# EAGLE schematic 17341 (EAGLE 7.6.0)

## Sheet 1 of 3
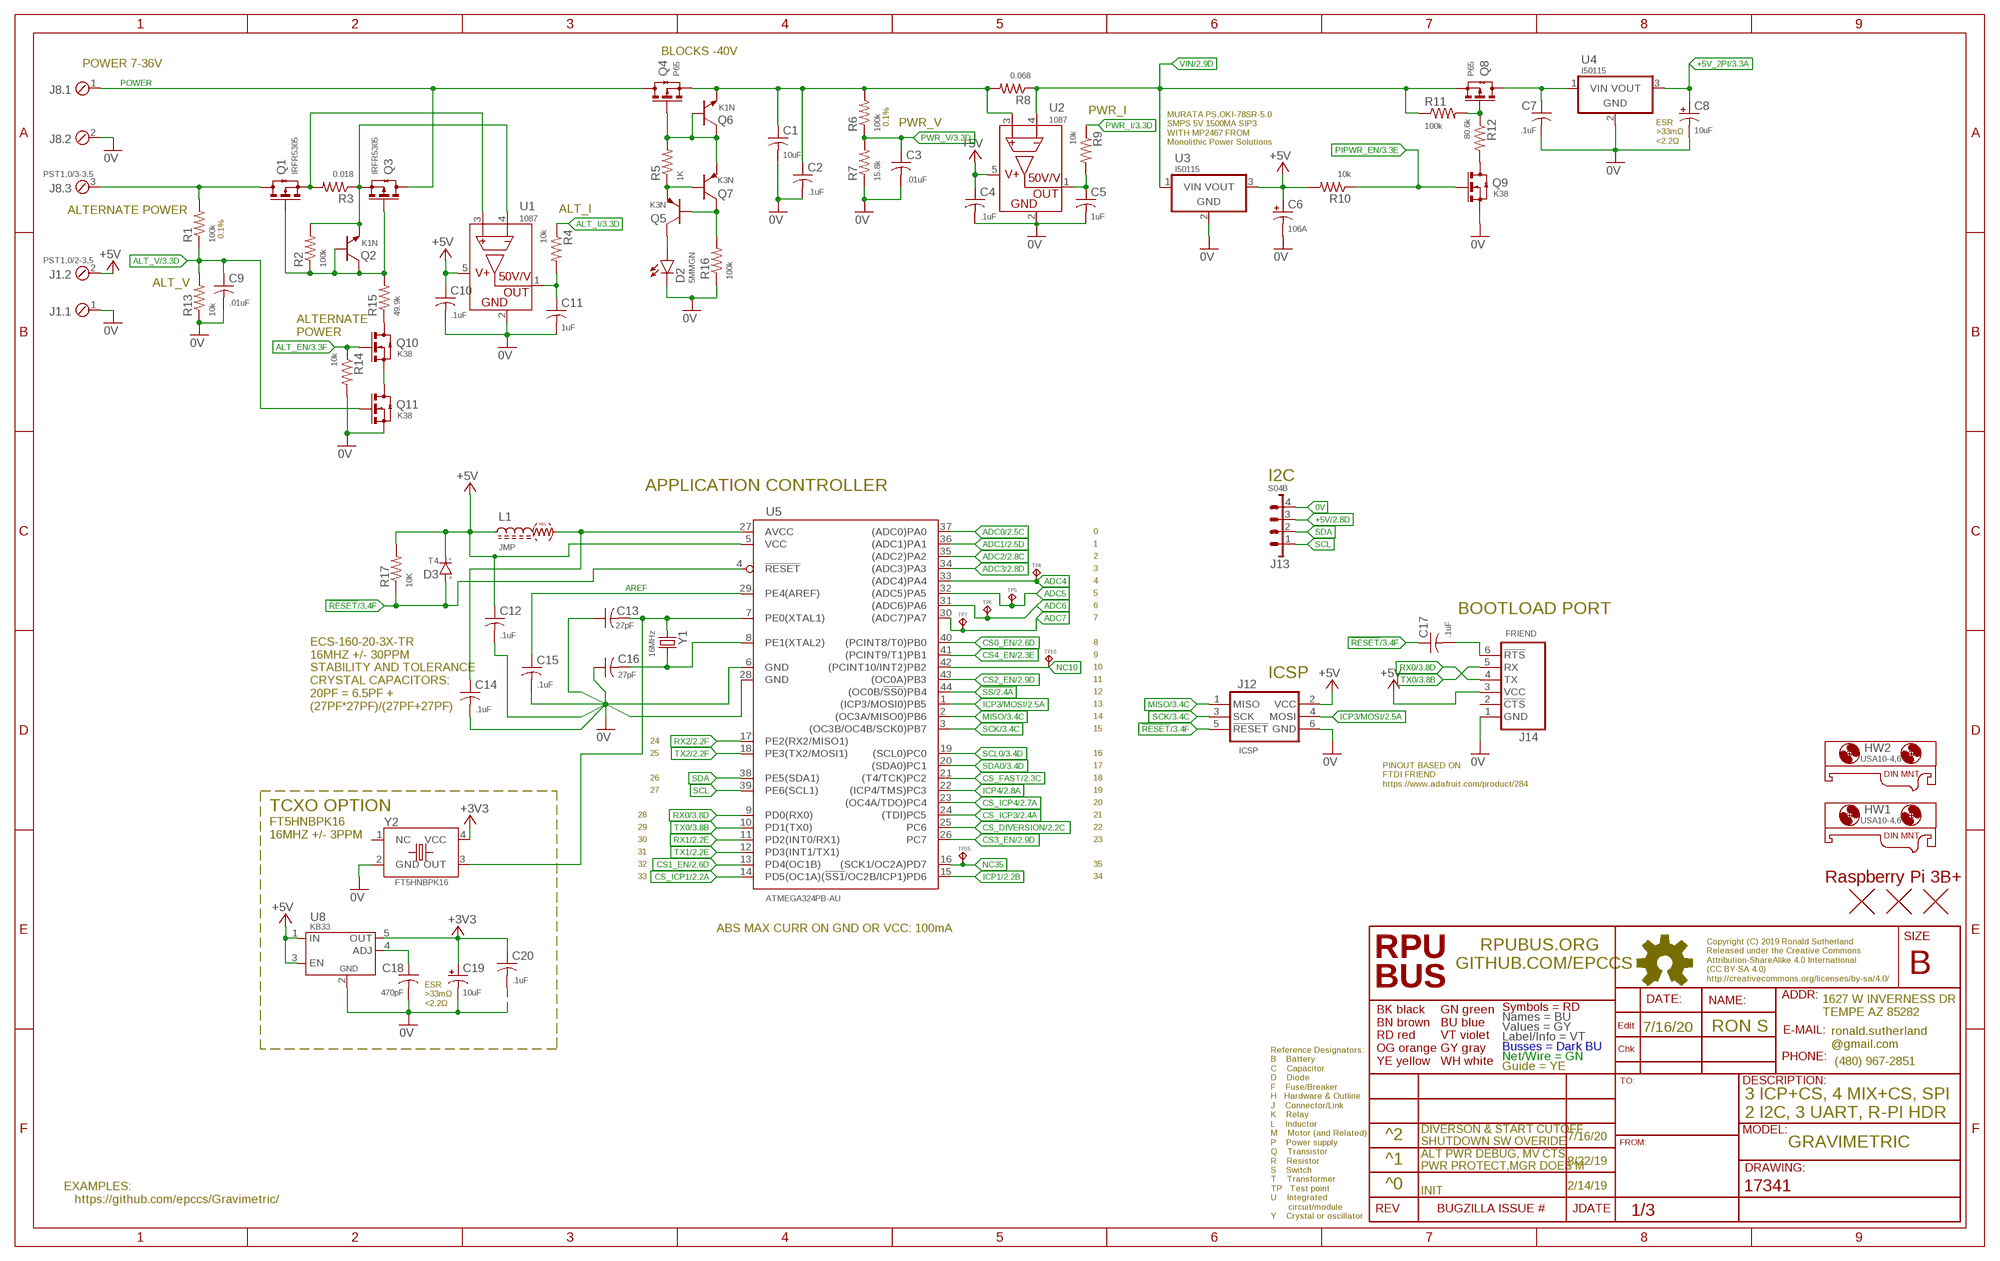
[diagram p0: schematic, sheet 1]

### Parts
C1  10uF  CC1206  [C1206(3216)]
C2  .1uF  CC0805A  [C0805(2012)]
C3  .01uF  CC0603A  [C0603(1608)]
C4  .1uF  CC0603A  [C0603(1608)]
C5  1uF  CC0805A  [C0805(2012)]
C6  106A  CT1206  [3216]
C7  .1uF  CC0603A  [C0603(1608)]
C8  10uF  CT1206  [3216]
C9  .01uF  CC0603A  [C0603(1608)]
C10  .1uF  CC0603A  [C0603(1608)]
C11  1uF  CC0805A  [C0805(2012)]
C12  .1uF  CC0603A  [C0603(1608)]
C13  27pF  CC0603A  [C0603(1608)]
C14  .1uF  CC0603A  [C0603(1608)]
C15  .1uF  CC0603A  [C0603(1608)]
C16  27pF  CC0603A  [C0603(1608)]
C17  .1uF  CC0603A  [C0603(1608)]
C18  470pF  CC0603A  [C0603(1608)]
C19  10uF  CT1206  [3216]
C20  .1uF  CC0603A  [C0603(1608)]
D2  5MMGN  LED5MM  [LED5MM]
D3  T4  DSOD123  [SOD123]
HW1  USA10-4,6  MOUNT-HOLE5.0  [USA10]
HW2  USA10-4,6  MOUNT-HOLE5.0  [USA10]
J1  PST1,0/2-3,5  MCV2  [MCV2]
J8  PST1,0/3-3,5  MCV3  [MCV3]
J12  ICSP  ISP-SPIPTH  [ISP]
J13  S04B  B04B  [B04B]
J14  FRIEND  [FRIEND]
L1  JMP  L0805  [C0805(2012)]
Q1  IRFR5305  N-CHDPAK  [DPAK]
Q2  K1N  NPNSOT23  [SOT23]
Q3  IRFR5305  N-CHDPAK  [DPAK]
Q4  P65  N-CHSOT23  [SOT23]
Q5  K3N  PNPSOT23  [SOT23]
Q6  K1N  NPNSOT23  [SOT23]
Q7  K3N  PNPSOT23  [SOT23]
Q8  P65  N-CHSOT23  [SOT23]
Q9  K38  N-CHSOT23  [SOT23]
Q10  K38  N-CHSOT23  [SOT23]
Q11  K38  N-CHSOT23  [SOT23]
R1  100k  R0805  [C0805(2012)]
R2  100k  R0805  [C0805(2012)]
R3  0.018  R1210  [C1210(3225)]
R4  10k  R0805  [C0805(2012)]
R5  1K  R0805  [C0805(2012)]
R6  100k  R0805  [C0805(2012)]
R7  15.8k  R0805  [C0805(2012)]
R8  0.068  R1210  [C1210(3225)]
R9  10k  R0805  [C0805(2012)]
R10  10k  R0805  [C0805(2012)]
R11  100k  R0805  [C0805(2012)]
R12  80.6k  R0805  [C0805(2012)]
R13  10k  R0805  [C0805(2012)]
R14  10k  R0805  [C0805(2012)]
R15  49.9k  R0805  [C0805(2012)]
R16  100k  R0805  [C0805(2012)]
R17  10K  R0805  [C0805(2012)]
TP4  TPPAD1-08  [P1-08]
TP5  TPPAD1-08  [P1-08]
TP6  TPPAD1-08  [P1-08]
TP7  TPPAD1-08  [P1-08]
TP10  TPPAD1-08  [P1-08]
TP35  TPPAD1-08  [P1-08]
U1  1087  ZXCT1087  [SOT23-5]
U2  1087  ZXCT1087  [SOT23-5]
U3  I50115  OKI-78SR-H  [OKI-78SR-H]
U4  I50115  OKI-78SR-H  [OKI-78SR-H]
U5  ATMEGA324PB-AU  [TQFP44]
U8  KB33  MIC5205  [SOT23-5,SOT25]
U$1  R-PI3B+  [R-PI3B+]
U$2  FIDUCIAL1.27  [FIDUCIAL-1.27]
U$3  FIDUCIAL1.27  [FIDUCIAL-1.27]
U$4  FIDUCIAL1.27  [FIDUCIAL-1.27]
Y1  16MHz  CSM-3X  [CSM-3X]
Y2  FT5HNBPK16  FT5HNBPK  [CRYSTAL5X3.2MM]

### Nets
0V: C1.2 C2.2 C3.2 C4.2 C5.2 C6.- C7.2 C8.- C9.2 C10.2 C11.2 C12.2 C13.1 C14.2 C15.2 C16.1 C18.2 C19.- C20.2 D2.K J1.1 J8.2 J12.6(GND) J13.4 J14.1(GND) Q9.2(S)(S) Q11.2(S)(S) R7.1 R13.1 R14.2 R16.1 U1.2(GND) U2.2(GND) U3.2(GND) U4.2(GND) U5.6(GND) U5.28(GND) U8.2(GND) Y2.2(GND) ; also sheet 2,3
!RESET!: C17.1 D3.A J12.5(!RESET) R17.1 U5.4(!RESET) ; also sheet 3
!SS: U5.44((OC0B/!SS0!)PB4) ; also sheet 2,3
+3V3: C19.+ C20.1 U8.5(OUT) Y2.4(VCC)
+5V: C4.1 C6.+ C10.1 C12.1 D3.C(K) J1.2 J12.2(VCC) J13.3 J14.3(VCC) L1.1 R10.2 R17.2 U1.5(VCC) U2.5(VCC) U3.3(VOUT) U5.5(VCC) U8.1(IN) U8.3(EN) ; also sheet 2,3
+5V_2PI: C8.+ U4.3(VOUT) ; also sheet 3
ADC0: U5.37((ADC0)PA0) ; also sheet 2
ADC1: U5.36((ADC1)PA1) ; also sheet 2
ADC2: U5.35((ADC2)PA2) ; also sheet 2
ADC3: U5.34((ADC3)PA3) ; also sheet 2
ADC4: TP4.TP U5.33((ADC4)PA4)
ADC5: TP5.TP U5.32((ADC5)PA5)
ADC6: TP6.TP U5.31((ADC6)PA6)
ADC7: TP7.TP U5.30((ADC7)PA7)
ALT_EN: Q10.1(G)(G) R14.1 ; also sheet 3
ALT_I: R4.1 ; also sheet 3
ALT_V: C9.1 Q11.1(G)(G) R1.1 R13.2 ; also sheet 3
AREF: C15.1 U5.29(PE4(AREF))
CS0_EN: U5.40((PCINT8/T0)PB0) ; also sheet 2
CS1_EN: U5.13(PD4(OC1B)) ; also sheet 2
CS2_EN: U5.43((OC0A)PB3) ; also sheet 2
CS3_EN: U5.26(PC7) ; also sheet 2
CS4_EN: U5.41((PCINT9/T1)PB1) ; also sheet 2
CS_DIVERSION: U5.25(PC6) ; also sheet 2
CS_FAST: U5.21((T4/TCK)PC2) ; also sheet 2
CS_ICP1: U5.14(PD5(OC1A)) ; also sheet 2
CS_ICP3: U5.24((TDI)PC5) ; also sheet 2
CS_ICP4: U5.23((OC4A/TDO)PC4) ; also sheet 2
ICP1: U5.15((!SS1!/OC2B/ICP1)PD6) ; also sheet 2
ICP3/MOSI: J12.4(MOSI) U5.1((ICP3/MOSI0)PB5) ; also sheet 2,3
ICP4: U5.22((ICP4/TMS)PC3) ; also sheet 2
MISO: J12.1(MISO) U5.2((OC3A/MISO0)PB6) ; also sheet 3
N$2: Q8.1(G)(G) R11.2 R12.1
N$4: Q9.3(D)(D) R12.2
N$5: Q5.B Q7.C R16.2
N$6: Q4.1(G)(G) Q6.B Q6.C Q7.E R5.2
N$7: D2.A Q5.C
N$8: C5.1 R9.2 U2.1(OUT)
N$10: Q5.E Q7.B R5.1
N$31: J8.3 Q1.SINK(D) R1.2
N$32: Q2.E Q3.3(S) R2.2 R3.1 U1.4(S-)
N$33: Q1.1(G) Q2.B Q2.C Q3.1(G) R2.1 R15.2
N$34: Q10.3(D)(D) R15.1
N$35: C17.2 J14.6(!RTS)
N$65: C11.1 R4.2 U1.1(OUT)
N$66: Q1.3(S) R3.2 U1.3(S+)
N$71: C16.2 U5.8(PE1(XTAL2)) Y1.2
N$75: C18.1 U8.4(ADJ)
N$77: C14.1 L1.2 U5.27(AVCC)
N$80: C13.2 U5.7(PE0(XTAL1)) Y1.1 Y2.3(OUT)
N$97: Q10.2(S)(S) Q11.3(D)(D)
NC10: TP10.TP U5.42((PCINT10/INT2)PB2)
NC35: TP35.TP U5.16((SCK1/OC2A)PD7)
PIPWR_EN: Q9.1(G)(G) R10.1 ; also sheet 3
POWER: J8.1 Q3.SINK(D) Q4.3(D)(D)
PWR_I: R9.1 ; also sheet 3
PWR_V: C3.1 R6.1 R7.2 ; also sheet 3
RX0: J14.4(TX) U5.9(PD0(RX0)) ; also sheet 3
RX1: U5.11(PD2(INT0/RX1)) ; also sheet 2
RX2: U5.17(PE2(RX2/MISO1)) ; also sheet 2
SCK: J12.3(SCK) U5.3((OC3B/OC4B/SCK0)PB7) ; also sheet 3
SCL: J13.1 U5.39(PE6(SCL1))
SCL0: U5.19((SCL0)PC0) ; also sheet 3
SDA: J13.2 U5.38(PE5(SDA1))
SDA0: U5.20((SDA0)PC1) ; also sheet 3
SHLD_VIN: C7.1 Q8.3(D)(D) U4.1(VIN)
TX0: J14.5(RX) U5.10(PD1(TX0)) ; also sheet 3
TX1: U5.12(PD3(INT1/TX1)) ; also sheet 2
TX2: U5.18(PE3(TX2/MOSI1)) ; also sheet 2
VIN: Q8.2(S)(S) R8.1 R11.1 U2.4(S-) U3.1(VIN) ; also sheet 2
VIN_S: C1.1 C2.1 Q4.2(S)(S) Q6.E R6.2 R8.2 U2.3(S+)
Unconnected: J14.2(!CTS) Y2.1(NC)

### Notes on the sheet
- BLOCKS -40V
- POWER 7-36V
- PWR_I
- 0.1% | PWR_V
- ESR
  >33mΩ
  <2.2Ω
- MURATA PS,OKI-78SR-5.0
  SMPS 5V 1500MA SIP3
  WITH MP2467 FROM 
  Monolithic Power Solutions
- ALTERNATE POWER | ALT_I
- 0.1%
- ALT_V
- ALTERNATE
  POWER
- I2C
- APPLICATION CONTROLLER
- 0
- 1
- 2
- 3
- 4
- 5
- 6
- BOOTLOAD PORT
- 7
- 8
- 9
- 10
- ICSP
- 11
- 12
- 13
- ECS-160-20-3X-TR
  16MHZ +/- 30PPM
  STABILITY AND TOLERANCE
  CRYSTAL CAPACITORS:
  20PF = 6.5PF +
  (27PF*27PF)/(27PF+27PF)
- 14
- 15
- 24
- 25 | 16
- 17
- 26 | 18
- PINOUT BASED ON
  FTDI FRIEND
  https://www.adafruit.com/product/284
- 27 | 19
- 20
- TCXO OPTION
- 28 | 21
- 29 | 22
- FT5HNBPK16
  16MHZ +/- 3PPM
- 30 | 23
- 31
- 32 | 35
- 33 | 34
- ABS MAX CURR ON GND OR VCC: 100mA
- ESR
  >33mΩ
  <2.2Ω
- 7/16/20 | RON S
- 3 ICP+CS, 4 MIX+CS, SPI
  2 I2C, 3 UART, R-PI HDR
- ^2 | 7/16/20
- DIVERSON & START CUTOFF
  SHUTDOWN SW OVERIDE
- GRAVIMETRIC
- ^1 | 8/22/19
- ALT PWR DEBUG, MV CTS
  PWR PROTECT,MGR DOES M
- ^0 | 2/14/19
- INIT
- EXAMPLES:
     https://github.com/epccs/Gravimetric/

## Sheet 2 of 3
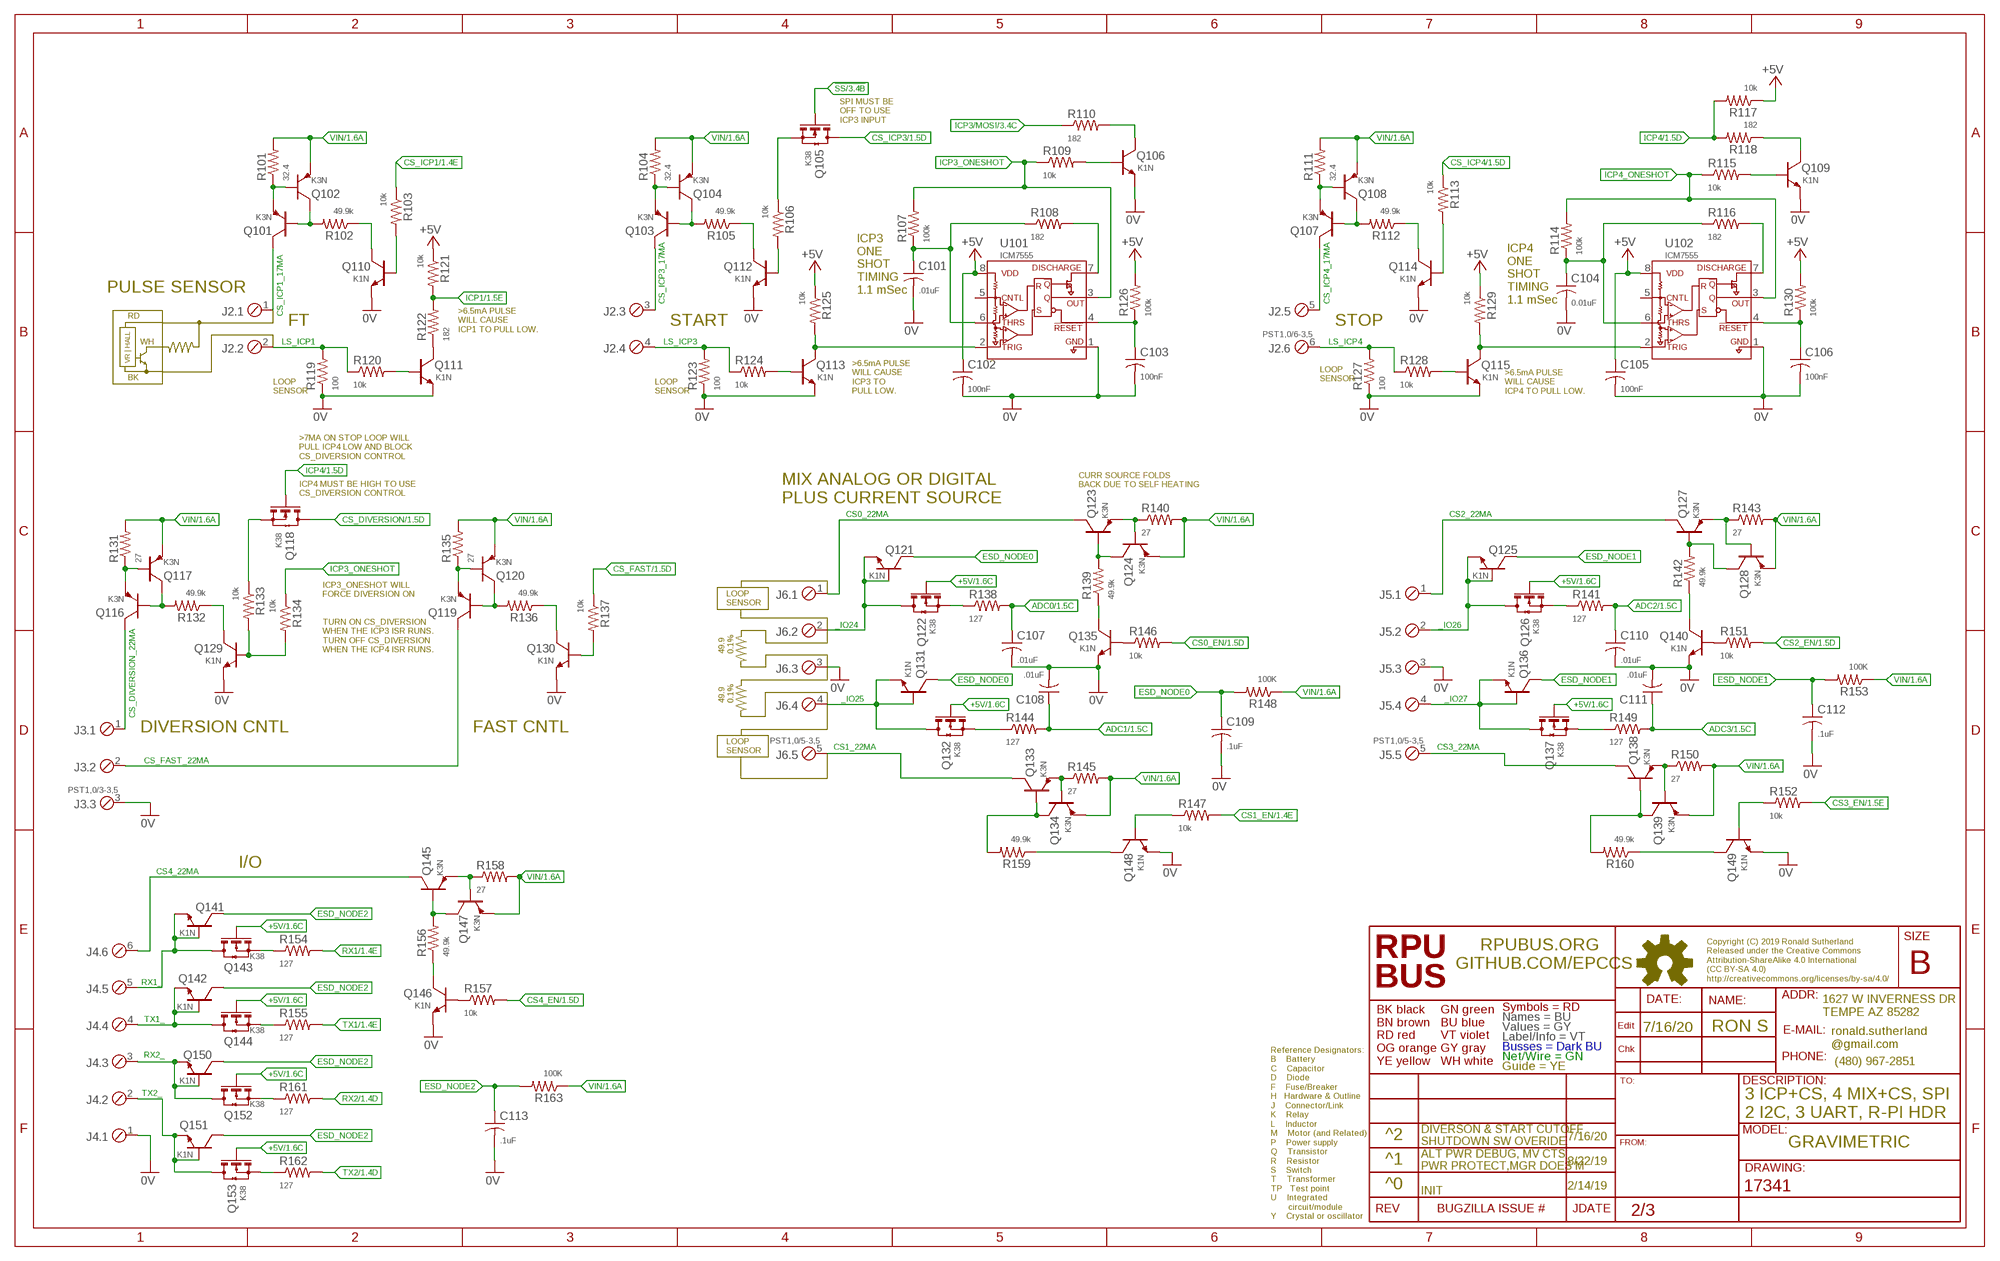
[diagram p1: schematic, sheet 2]

### Parts
C101  .01uF  CC0805A  [C0805(2012)]
C102  100nF  CC0603A  [C0603(1608)]
C103  100nF  CC0603A  [C0603(1608)]
C104  0.01uF  CC0805A  [C0805(2012)]
C105  100nF  CC0603A  [C0603(1608)]
C106  100nF  CC0603A  [C0603(1608)]
C107  .01uF  CC0603A  [C0603(1608)]
C108  .01uF  CC0603A  [C0603(1608)]
C109  .1uF  CC0603A  [C0603(1608)]
C110  .01uF  CC0603A  [C0603(1608)]
C111  .01uF  CC0603A  [C0603(1608)]
C112  .1uF  CC0603A  [C0603(1608)]
C113  .1uF  CC0603A  [C0603(1608)]
J2  PST1,0/6-3,5  MCV6  [MCV6]
J3  PST1,0/3-3,5  MCV3  [MCV3]
J4  MCV6  [MCV6]
J5  PST1,0/5-3,5  MCV5  [MCV5]
J6  PST1,0/5-3,5  MCV5  [MCV5]
Q101  K3N  PNPSOT23  [SOT23]
Q102  K3N  PNPSOT23  [SOT23]
Q103  K3N  PNPSOT23  [SOT23]
Q104  K3N  PNPSOT23  [SOT23]
Q105  K38  N-CHSOT23  [SOT23]
Q106  K1N  NPNSOT23  [SOT23]
Q107  K3N  PNPSOT23  [SOT23]
Q108  K3N  PNPSOT23  [SOT23]
Q109  K1N  NPNSOT23  [SOT23]
Q110  K1N  NPNSOT23  [SOT23]
Q111  K1N  NPNSOT23  [SOT23]
Q112  K1N  NPNSOT23  [SOT23]
Q113  K1N  NPNSOT23  [SOT23]
Q114  K1N  NPNSOT23  [SOT23]
Q115  K1N  NPNSOT23  [SOT23]
Q116  K3N  PNPSOT23  [SOT23]
Q117  K3N  PNPSOT23  [SOT23]
Q118  K38  N-CHSOT23  [SOT23]
Q119  K3N  PNPSOT23  [SOT23]
Q120  K3N  PNPSOT23  [SOT23]
Q121  K1N  NPNSOT23  [SOT23]
Q122  K38  N-CHSOT23  [SOT23]
Q123  K3N  PNPSOT23  [SOT23]
Q124  K3N  PNPSOT23  [SOT23]
Q125  K1N  NPNSOT23  [SOT23]
Q126  K38  N-CHSOT23  [SOT23]
Q127  K3N  PNPSOT23  [SOT23]
Q128  K3N  PNPSOT23  [SOT23]
Q129  K1N  NPNSOT23  [SOT23]
Q130  K1N  NPNSOT23  [SOT23]
Q131  K1N  NPNSOT23  [SOT23]
Q132  K38  N-CHSOT23  [SOT23]
Q133  K3N  PNPSOT23  [SOT23]
Q134  K3N  PNPSOT23  [SOT23]
Q135  K1N  NPNSOT23  [SOT23]
Q136  K1N  NPNSOT23  [SOT23]
Q137  K38  N-CHSOT23  [SOT23]
Q138  K3N  PNPSOT23  [SOT23]
Q139  K3N  PNPSOT23  [SOT23]
Q140  K1N  NPNSOT23  [SOT23]
Q141  K1N  NPNSOT23  [SOT23]
Q142  K1N  NPNSOT23  [SOT23]
Q143  K38  N-CHSOT23  [SOT23]
Q144  K38  N-CHSOT23  [SOT23]
Q145  K3N  PNPSOT23  [SOT23]
Q146  K1N  NPNSOT23  [SOT23]
Q147  K3N  PNPSOT23  [SOT23]
Q148  K1N  NPNSOT23  [SOT23]
Q149  K1N  NPNSOT23  [SOT23]
Q150  K1N  NPNSOT23  [SOT23]
Q151  K1N  NPNSOT23  [SOT23]
Q152  K38  N-CHSOT23  [SOT23]
Q153  K38  N-CHSOT23  [SOT23]
R101  32.4  R0805  [C0805(2012)]
R102  49.9k  R0805  [C0805(2012)]
R103  10k  R0805  [C0805(2012)]
R104  32.4  R0805  [C0805(2012)]
R105  49.9k  R0805  [C0805(2012)]
R106  10k  R0805  [C0805(2012)]
R107  100k  R0805  [C0805(2012)]
R108  182  R0805  [C0805(2012)]
R109  10k  R0805  [C0805(2012)]
R110  182  R0805  [C0805(2012)]
R111  32.4  R0805  [C0805(2012)]
R112  49.9k  R0805  [C0805(2012)]
R113  10k  R0805  [C0805(2012)]
R114  100k  R0805  [C0805(2012)]
R115  10k  R0805  [C0805(2012)]
R116  182  R0805  [C0805(2012)]
R117  10k  R0805  [C0805(2012)]
R118  182  R0805  [C0805(2012)]
R119  100  R0805  [C0805(2012)]
R120  10k  R0805  [C0805(2012)]
R121  10k  R0805  [C0805(2012)]
R122  182  R0805  [C0805(2012)]
R123  100  R0805  [C0805(2012)]
R124  10k  R0805  [C0805(2012)]
R125  10k  R0805  [C0805(2012)]
R126  100k  R0805  [C0805(2012)]
R127  100  R0805  [C0805(2012)]
R128  10k  R0805  [C0805(2012)]
R129  10k  R0805  [C0805(2012)]
R130  100k  R0805  [C0805(2012)]
R131  27  R0805  [C0805(2012)]
R132  49.9k  R0805  [C0805(2012)]
R133  10k  R0805  [C0805(2012)]
R134  10k  R0805  [C0805(2012)]
R135  27  R0805  [C0805(2012)]
R136  49.9k  R0805  [C0805(2012)]
R137  10k  R0805  [C0805(2012)]
R138  127  R0805  [C0805(2012)]
R139  49.9k  R0805  [C0805(2012)]
R140  27  R0805  [C0805(2012)]
R141  127  R0805  [C0805(2012)]
R142  49.9k  R0805  [C0805(2012)]
R143  27  R0805  [C0805(2012)]
R144  127  R0805  [C0805(2012)]
R145  27  R0805  [C0805(2012)]
R146  10k  R0805  [C0805(2012)]
R147  10k  R0805  [C0805(2012)]
R148  100K  R0805  [C0805(2012)]
R149  127  R0805  [C0805(2012)]
R150  27  R0805  [C0805(2012)]
R151  10k  R0805  [C0805(2012)]
R152  10k  R0805  [C0805(2012)]
R153  100K  R0805  [C0805(2012)]
R154  127  R0805  [C0805(2012)]
R155  127  R0805  [C0805(2012)]
R156  49.9k  R0805  [C0805(2012)]
R157  10k  R0805  [C0805(2012)]
R158  27  R0805  [C0805(2012)]
R159  49.9k  R0805  [C0805(2012)]
R160  49.9k  R0805  [C0805(2012)]
R161  127  R0805  [C0805(2012)]
R162  127  R0805  [C0805(2012)]
R163  100K  R0805  [C0805(2012)]
U101  ICM7555  [SOIC8]
U102  ICM7555  [SOIC8]

### Nets
0V: C101.2 C102.2 C103.2 C104.2 C105.2 C106.2 C107.2 C108.2 C109.2 C110.2 C111.2 C112.2 C113.2 J3.3 J4.1 J5.3 J6.3 Q106.E Q109.E Q110.E Q111.E Q112.E Q113.E Q114.E Q115.E Q129.E Q130.E Q135.E Q140.E Q146.E Q148.E Q149.E R119.1 R123.1 R127.1 U101.1(GND) U102.1(GND) ; also sheet 1,3
!SS: Q105.1(G)(G) ; also sheet 1,3
+5V: C102.1 C105.1 Q122.1(G)(G) Q126.1(G)(G) Q132.1(G)(G) Q137.1(G)(G) Q143.1(G)(G) Q144.1(G)(G) Q152.1(G)(G) Q153.1(G)(G) R117.1 R121.1 R125.1 R126.2 R129.1 R130.2 U101.8(VDD) U102.8(VDD) ; also sheet 1,3
_IO24: J6.2 Q121.B Q121.E Q122.3(D)(D)
_IO25: J6.4 Q131.B Q131.E Q132.3(D)(D)
_IO26: J5.2 Q125.B Q125.E Q126.3(D)(D)
_IO27: J5.4 Q136.B Q136.E Q137.3(D)(D)
ADC0: C107.1 R138.2 ; also sheet 1
ADC1: C108.1 R144.2 ; also sheet 1
ADC2: C110.1 R141.2 ; also sheet 1
ADC3: C111.1 R149.2 ; also sheet 1
CS0_22MA: J6.1 Q123.C
CS0_EN: R146.2 ; also sheet 1
CS1_22MA: J6.5 Q133.C
CS1_EN: R147.2 ; also sheet 1
CS2_22MA: J5.1 Q127.C
CS2_EN: R151.2 ; also sheet 1
CS3_22MA: J5.5 Q138.C
CS3_EN: R152.2 ; also sheet 1
CS4_22MA: J4.6 Q145.C
CS4_EN: R157.2 ; also sheet 1
CS_DIVERSION: Q118.3(D)(D) ; also sheet 1
CS_DIVERSION_22MA: J3.1 Q116.C
CS_FAST: R137.1 ; also sheet 1
CS_FAST_22MA: J3.2 Q119.C
CS_ICP1: R103.1 ; also sheet 1
CS_ICP1_17MA: J2.1 Q101.C
CS_ICP3: Q105.3(D)(D) ; also sheet 1
CS_ICP3_17MA: J2.3 Q103.C
CS_ICP4: R113.1 ; also sheet 1
CS_ICP4_17MA: J2.5 Q107.C
ESD_NODE0: C109.1 Q121.C Q131.C R148.2
ESD_NODE1: C112.1 Q125.C Q136.C R153.2
ESD_NODE2: C113.1 Q141.C Q142.C Q150.C Q151.C R163.2
ICP1: R121.2 R122.2 ; also sheet 1
ICP1__: Q111.B R120.2
ICP3/MOSI: R110.1 ; also sheet 1,3
ICP3__: Q113.B R124.2
ICP3_ONESHOT: R107.2 R109.1 R134.1 U101.3(OUT)
ICP3_TIMING_RAMP: C101.1 R107.1 R108.1 U101.6(THRS)
ICP4: Q118.1(G)(G) R117.2 R118.2 ; also sheet 1
ICP4__: Q115.B R128.2
ICP4_ONESHOT: R114.2 R115.1 U102.3(OUT)
ICP4_TIMING_RAMP: C104.1 R114.1 R116.1 U102.6(THRS)
LS_ICP1: J2.2 R119.2 R120.1
LS_ICP3: J2.4 R123.2 R124.1
LS_ICP4: J2.6 R127.2 R128.1
N$1: Q127.E Q128.B R143.1
N$3: Q110.B R103.2
N$9: Q127.B Q128.C R142.2
N$11: Q103.E Q104.B R104.1
N$12: Q138.E Q139.B R150.1
N$13: Q132.2(S)(S) R144.1
N$14: Q122.2(S)(S) R138.1
N$15: Q138.B Q139.C R160.2
N$16: Q103.B Q104.C R105.2
N$18: Q115.C R129.2 U102.2(TRIG)
N$19: Q148.C R159.1
N$20: Q123.E Q124.B R140.1
N$21: Q135.C R139.1
N$22: Q112.B R106.2
N$23: Q123.B Q124.C R139.2
N$24: Q107.E Q108.B R111.1
N$25: Q107.B Q108.C R112.2
N$27: Q109.B R115.2
N$28: Q133.E Q134.B R145.1
N$29: Q133.B Q134.C R159.2
N$30: Q114.B R113.2
N$36: Q148.B R147.1
N$37: Q135.B R146.1
N$38: Q149.C R160.1
N$39: Q110.C R102.1
N$40: Q112.C R105.1
N$41: Q114.C R112.1
N$42: Q105.2(S)(S) R106.1
N$43: Q113.C R125.2 U101.2(TRIG)
N$44: Q109.C R118.1
N$45: Q116.E Q117.B R131.1
N$46: R116.2 U102.7(DISCHARGE)
N$47: C106.1 R130.1 U102.4(!RESET)
N$48: Q106.B R109.2
N$49: R108.2 U101.7(DISCHARGE)
N$50: Q106.C R110.2
N$51: C103.1 R126.1 U101.4(!RESET)
N$52: Q116.B Q117.C R132.2
N$53: Q129.B R133.2 R134.2
N$54: Q129.C R132.1
N$55: Q118.2(S)(S) R133.1
N$56: Q119.E Q120.B R135.1
N$57: Q119.B Q120.C R136.2
N$58: Q130.B R137.2
N$59: Q130.C R136.1
N$60: Q140.C R142.1
N$61: Q137.2(S)(S) R149.1
N$62: Q126.2(S)(S) R141.1
N$63: Q149.B R152.1
N$64: Q140.B R151.1
N$67: Q145.E Q147.B R158.1
N$68: Q145.B Q147.C R156.2
N$69: Q153.2(S)(S) R162.1
N$70: Q152.2(S)(S) R161.1
N$72: Q146.C R156.1
N$73: Q144.2(S)(S) R155.1
N$74: Q143.2(S)(S) R154.1
N$76: Q146.B R157.1
N$108: Q111.C R122.1
N$114: Q101.E Q102.B R101.1
N$119: Q101.B Q102.C R102.2
RX1: R154.2 ; also sheet 1
RX1_: J4.5 Q141.B Q141.E Q143.3(D)(D)
RX2: R161.2 ; also sheet 1
RX2_: J4.3 Q150.B Q150.E Q152.3(D)(D)
TX1: R155.2 ; also sheet 1
TX1_: J4.4 Q142.B Q142.E Q144.3(D)(D)
TX2: R162.2 ; also sheet 1
TX2_: J4.2 Q151.B Q151.E Q153.3(D)(D)
VIN: Q102.E Q104.E Q108.E Q117.E Q120.E Q124.E Q128.E Q134.E Q139.E Q147.E R101.2 R104.2 R111.2 R131.2 R135.2 R140.2 R143.2 R145.2 R148.1 R150.2 R153.1 R158.2 R163.1 ; also sheet 1
Unconnected: U101.5(CNTL) U102.5(CNTL)

### Notes on the sheet
- SPI MUST BE
  OFF TO USE
  ICP3 INPUT
- PULSE SENSOR
- ICP3
  ONE 
  SHOT
  TIMING
  1.1 mSec
- ICP4
  ONE 
  SHOT
  TIMING
  1.1 mSec
- RD
- FT | START | STOP
- >6.5mA PULSE 
  WILL CAUSE 
  ICP1 TO PULL LOW.
- WH
- VR | HALL
- BK
- LOOP 
  SENSOR
- LOOP 
  SENSOR
- LOOP 
  SENSOR
- >6.5mA PULSE 
  WILL CAUSE 
  ICP3 TO
  PULL LOW.
- >6.5mA PULSE 
  WILL CAUSE 
  ICP4 TO PULL LOW.
- >7MA ON STOP LOOP WILL
  PULL ICP4 LOW AND BLOCK 
  CS_DIVERSION CONTROL
- CURR SOURCE FOLDS 
  BACK DUE TO SELF HEATING
- ICP4 MUST BE HIGH TO USE
  CS_DIVERSION CONTROL
- MIX ANALOG OR DIGITAL
  PLUS CURRENT SOURCE
- ICP3_ONESHOT WILL
  FORCE DIVERSION ON
- LOOP 
  SENSOR
- TURN ON CS_DIVERSION
  WHEN THE ICP3 ISR RUNS.
  TURN OFF CS_DIVERSION
  WHEN THE ICP4 ISR RUNS.
- 49.9 
  0.1%
- 49.9
  0.1%
- DIVERSION CNTL | FAST CNTL
- LOOP 
  SENSOR
- I/O
- 7/16/20 | RON S
- 3 ICP+CS, 4 MIX+CS, SPI
  2 I2C, 3 UART, R-PI HDR
- ^2 | 7/16/20
- DIVERSON & START CUTOFF
  SHUTDOWN SW OVERIDE
- GRAVIMETRIC
- ^1 | 8/22/19
- ALT PWR DEBUG, MV CTS
  PWR PROTECT,MGR DOES M
- ^0 | 2/14/19
- INIT

## Sheet 3 of 3
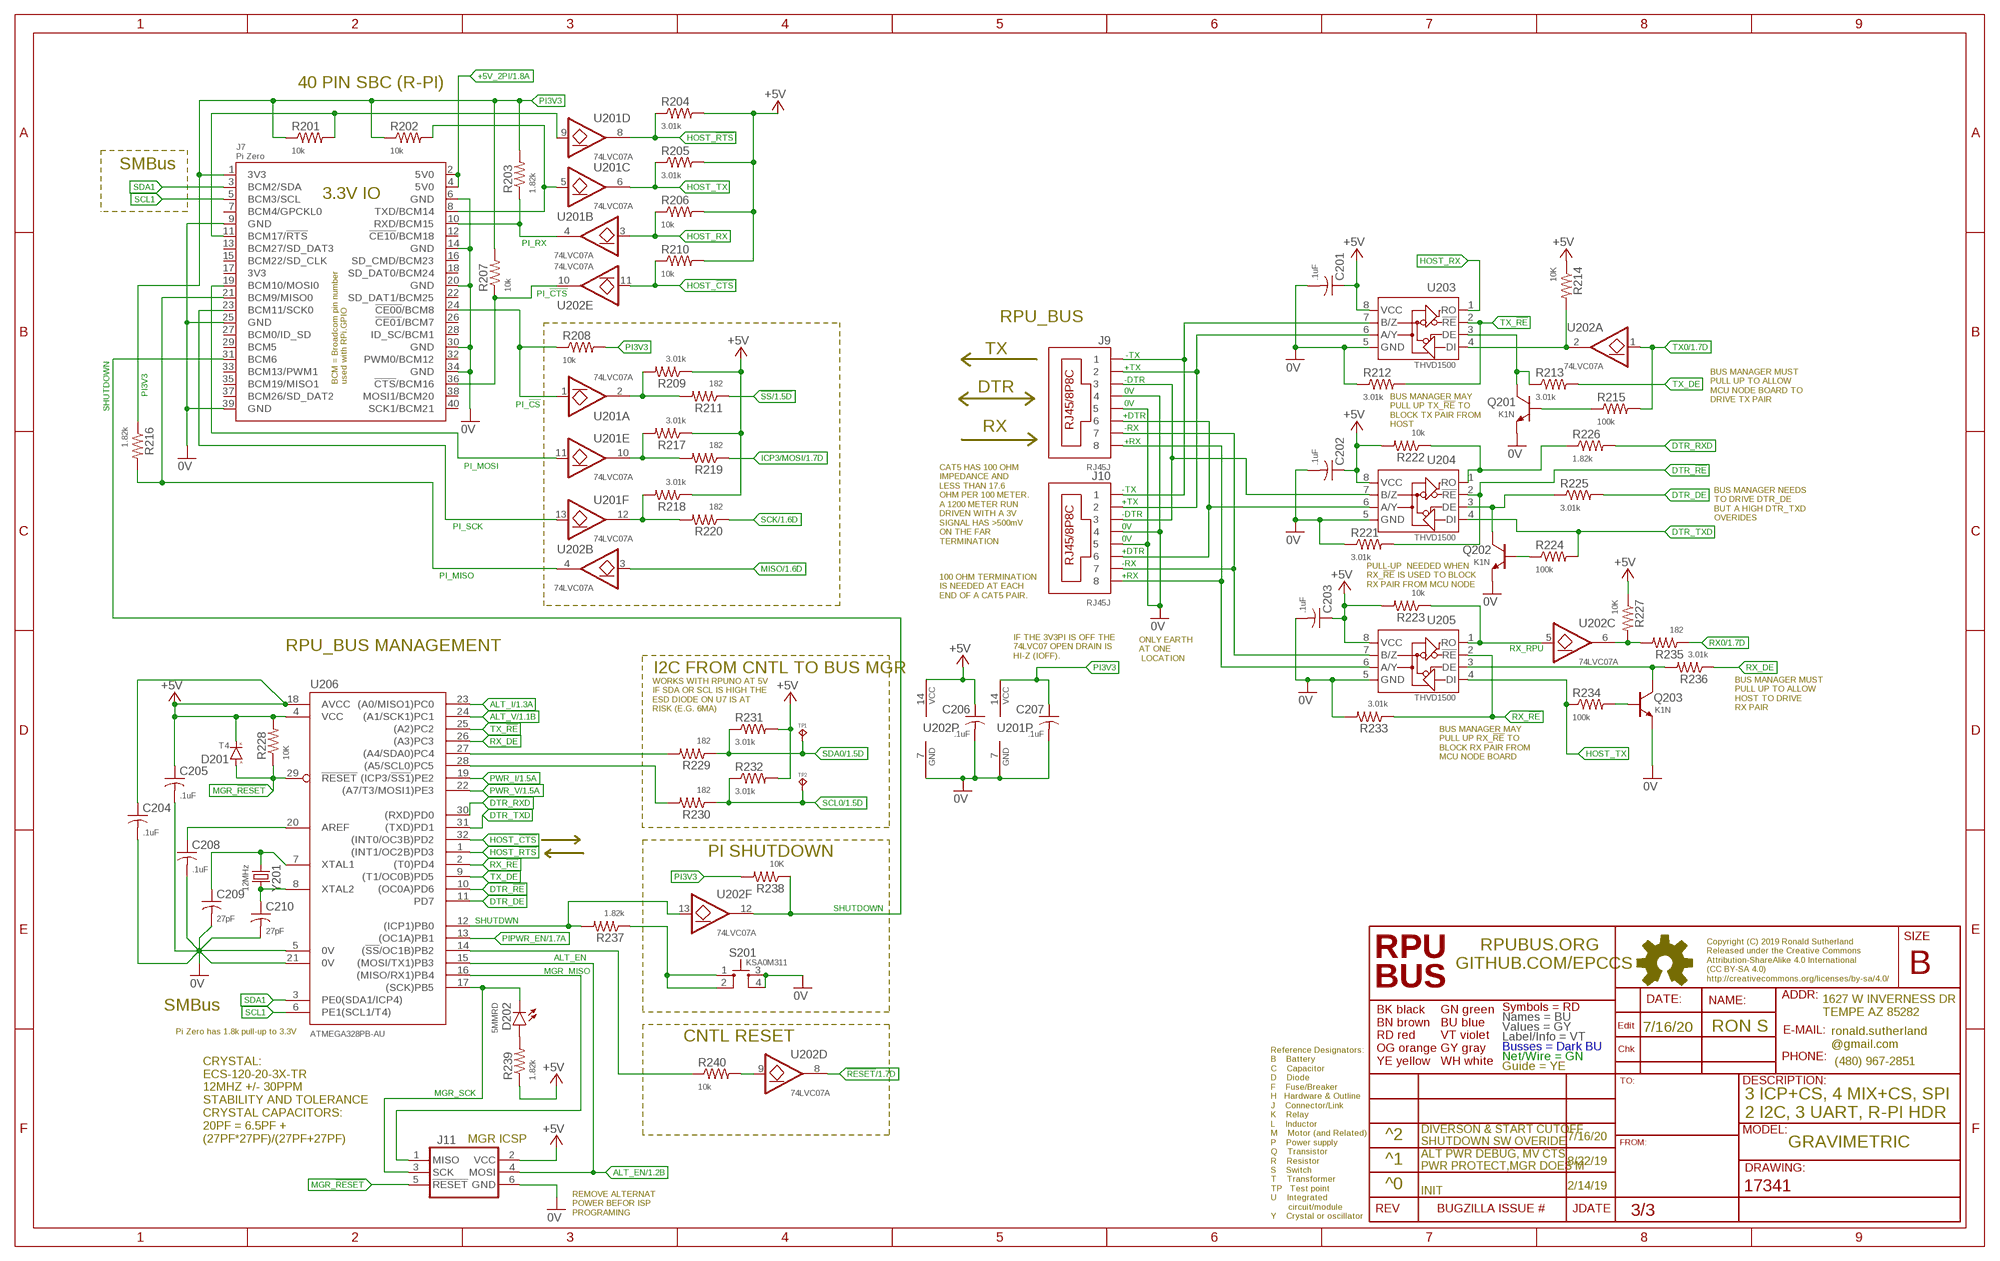
[diagram p2: schematic, sheet 3]

### Parts
C201  .1uF  CC0603A  [C0603(1608)]
C202  .1uF  CC0603A  [C0603(1608)]
C203  .1uF  CC0603A  [C0603(1608)]
C204  .1uF  CC0603A  [C0603(1608)]
C205  .1uF  CC0603A  [C0603(1608)]
C206  .1uF  CC0603A  [C0603(1608)]
C207  .1uF  CC0603A  [C0603(1608)]
C208  .1uF  CC0603A  [C0603(1608)]
C209  27pF  CC0603A  [C0603(1608)]
C210  27pF  CC0603A  [C0603(1608)]
D201  T4  DSOD123  [SOD123]
D202  5MMRD  LED5MM  [LED5MM]
J7  Pi Zero  RPI-ZERO90  [RASPI_ZERO_V40PIN]
J9  RJ45J  RJ45-8HZT  [RJ45-8HZT]
J10  RJ45J  RJ45-8HZT  [RJ45-8HZT]
J11  ISP-SPIPTH  [ISP]
Q201  K1N  NPNSOT23  [SOT23]
Q202  K1N  NPNSOT23  [SOT23]
Q203  K1N  NPNSOT23  [SOT23]
R201  10k  R0805  [C0805(2012)]
R202  10k  R0805  [C0805(2012)]
R203  1.82k  R0805  [C0805(2012)]
R204  3.01k  R0805  [C0805(2012)]
R205  3.01k  R0805  [C0805(2012)]
R206  10k  R0805  [C0805(2012)]
R207  10k  R0805  [C0805(2012)]
R208  10k  R0805  [C0805(2012)]
R209  3.01k  R0805  [C0805(2012)]
R210  10k  R0805  [C0805(2012)]
R211  182  R0805  [C0805(2012)]
R212  3.01k  R0805  [C0805(2012)]
R213  3.01k  R0805  [C0805(2012)]
R214  10K  R0805  [C0805(2012)]
R215  100k  R0805  [C0805(2012)]
R216  1.82k  R0805  [C0805(2012)]
R217  3.01k  R0805  [C0805(2012)]
R218  3.01k  R0805  [C0805(2012)]
R219  182  R0805  [C0805(2012)]
R220  182  R0805  [C0805(2012)]
R221  3.01k  R0805  [C0805(2012)]
R222  10k  R0805  [C0805(2012)]
R223  10k  R0805  [C0805(2012)]
R224  100k  R0805  [C0805(2012)]
R225  3.01k  R0805  [C0805(2012)]
R226  1.82k  R0805  [C0805(2012)]
R227  10K  R0805  [C0805(2012)]
R228  10K  R0805  [C0805(2012)]
R229  182  R0805  [C0805(2012)]
R230  182  R0805  [C0805(2012)]
R231  3.01k  R0805  [C0805(2012)]
R232  3.01k  R0805  [C0805(2012)]
R233  3.01k  R0805  [C0805(2012)]
R234  100k  R0805  [C0805(2012)]
R235  182  R0805  [C0805(2012)]
R236  3.01k  R0805  [C0805(2012)]
R237  1.82k  R0805  [C0805(2012)]
R238  10K  R0805  [C0805(2012)]
R239  1.82k  R0805  [C0805(2012)]
R240  10k  R0805  [C0805(2012)]
S201  KSA0M311  [0M311]
TP1  TPPAD1-08  [P1-08]
TP2  TPPAD1-08  [P1-08]
U201  74LVC07A  7407D  [14SOIC]
U202  74LVC07A  7407D  [14SOIC]
U203  THVD1500  ISL3172EIBZ  [SOIC8]
U204  THVD1500  ISL3172EIBZ  [SOIC8]
U205  THVD1500  ISL3172EIBZ  [SOIC8]
U206  ATMEGA328PB-AU  [TQFP32-08]
Y201  12MHz  CSM-3X  [CSM-3X]

### Nets
0V: C201.2 C202.2 C203.2 C204.2 C205.2 C206.2 C207.2 C208.2 C209.2 C210.2 J7.6(GND) J7.9(GND) J7.14(GND) J7.20(GND) J7.25(GND) J7.30(GND) J7.34(GND) J7.39(GND) J9.4 J9.5 J10.4 J10.5 J11.6(GND) Q201.E Q202.E Q203.E R212.1 R221.1 R233.2 S201.3 S201.4 U201.7(P:GND) U202.7(P:GND) U203.5(GND) U204.5(GND) U205.5(GND) U206.5(0V) U206.21(0V) ; also sheet 1,2
!RESET!: U202.8(D:O) ; also sheet 1
!SS: R211.1 ; also sheet 1,2
+5V: C201.1 C202.1 C203.1 C204.1 C205.1 C206.1 D201.C(K) J11.2(VCC) R204.2 R205.2 R206.2 R209.1 R210.2 R214.1 R217.1 R218.1 R222.2 R223.2 R227.1 R228.2 R231.2 R232.2 R239.1 U202.14(P:VCC) U203.8(VCC) U204.8(VCC) U205.8(VCC) U206.4(VCC) U206.18(AVCC) ; also sheet 1,2
+5V_2PI: J7.2(5V0) J7.4(5V0) ; also sheet 1
+DTR: J9.6 J10.6 U204.6(A/Y)
+RX: J9.8 J10.8 U205.6(A/Y)
+TX: J9.2 J10.2 U203.6(A/Y)
-DTR: J9.3 J10.3 U204.7(B/Z)
-RX: J9.7 J10.7 U205.7(B/Z)
-TX: J9.1 J10.1 U203.7(B/Z)
ALT_EN: J11.4(MOSI) U206.15((MOSI/TX1)PB3) ; also sheet 1
ALT_I: U206.23((A0/MISO1)PC0) ; also sheet 1
ALT_V: U206.24((A1/SCK1)PC1) ; also sheet 1
DTR_!RE: R221.2 U204.2(!RE) U206.10((OC0A)PD6)
DTR_DE: R225.2 U206.11(PD7)
DTR_RXD: R226.2 U206.30((RXD)PD0)
DTR_TXD: R224.2 U204.4(DI) U206.31((TXD)PD1)
HOST_!CTS: R210.1 U202.11(E:I) U206.32((INT0/OC3B)PD2)
HOST_!RTS: R204.1 U201.8(D:O) U206.1((INT1/OC2B)PD3)
HOST_RX: R206.1 U201.3(B:I) U203.1(RO)
HOST_TX: R205.1 R234.1 U201.6(C:O) U205.4(DI)
ICP3/MOSI: R219.1 ; also sheet 1,2
MGR_!RESET: D201.A J11.5(!RESET) R228.1 U206.29(!RESET)
MGR_!SS!: R240.1 U206.14((!SS!/OC1B)PB2)
MGR_AREF: C208.1 U206.20(AREF)
MGR_MISO: J11.1(MISO) U206.16((MISO/RX1)PB4)
MGR_SCK: D202.K J11.3(SCK) U206.17((SCK)PB5)
MISO: U202.3(B:I) ; also sheet 1
N$78: R227.2 R235.2 U202.6(C:O)
N$79: Q201.B R215.1
N$81: Q201.C R213.1 U203.3(DE)
N$82: R222.1 R226.1 U204.1(RO)
N$83: Q202.C R225.1 U204.3(DE)
N$84: Q202.B R224.1
N$85: Q203.B R234.2
N$86: D202.A R239.2
N$87: Q203.C R236.2 U205.3(DE)
N$88: R240.2 U202.9(D:I)
N$89: J7.8(TXD/BCM14) R202.2 U201.5(C:I)
N$90: J7.11(BCM17/!RTS!) R201.2 U201.9(D:I)
N$91: R218.2 R220.2 U201.12(F:O)
N$92: R217.2 R219.2 U201.10(E:O)
N$93: R237.1 S201.1 S201.2
N$94: R229.2 U206.27((A4/SDA0)PC4)
N$95: R230.2 U206.28((A5/SCL0)PC5)
N$96: R209.2 R211.2 U201.2(A:O)
PI3V3: C207.1 J7.1(3V3) R201.1 R202.1 R203.2 R207.2 R208.2 R216.1 R238.2 U201.14(P:VCC)
PI_!CS: J7.24(!CE00!/BCM8) R208.1 U201.1(A:I)
PI_!CTS: J7.36(!CTS!/BCM16) R207.1 U202.10(E:O)
PI_MISO: J7.21(BCM9/MISO0) R216.2 U202.4(B:O)
PI_MOSI: J7.19(BCM10/MOSI0) U201.11(E:I)
PI_RX: J7.10(RXD/BCM15) R203.1 U201.4(B:O)
PI_SCK: J7.23(BCM11/SCK0) U201.13(F:I)
PIPWR_EN: U206.13((OC1A)PB1) ; also sheet 1
PWR_I: U206.19((ICP3/!SS1!)PE2) ; also sheet 1
PWR_V: U206.22((A7/T3/MOSI1)PE3) ; also sheet 1
RX0: R235.1 ; also sheet 1
RX_!RE: R233.1 U205.2(!RE) U206.2((T0)PD4)
RX_DE: R236.1 U206.26((A3)PC3)
RX_RPU: R223.1 U202.5(C:I) U205.1(RO)
SCK: R220.1 ; also sheet 1
SCL0: R230.1 R232.1 TP2.TP ; also sheet 1
SCL1: J7.5(BCM3/SCL) U206.6(PE1(SCL1/T4))
SDA0: R229.1 R231.1 TP1.TP ; also sheet 1
SDA1: J7.3(BCM2/SDA) U206.3(PE0(SDA1/ICP4))
SHUTDOWN: J7.31(BCM6) R238.1 U202.12(F:O)
SHUTDWN: R237.2 U202.13(F:I) U206.12((ICP1)PB0)
TX0: R215.2 U202.1(A:I) ; also sheet 1
TX_!RE: R212.2 U203.2(!RE) U206.25((A2)PC2)
TX_DE: R213.2 U206.9((T1/OC0B)PD5)
TX_RPU: R214.2 U202.2(A:O) U203.4(DI)
XTAL1: C209.1 U206.7(XTAL1) Y201.1
XTAL2: C210.1 U206.8(XTAL2) Y201.2
Unconnected: J7.7(BCM4/GPCKL0) J7.12(!CE10!/BCM18) J7.13(BCM27/SD_DAT3) J7.15(BCM22/SD_CLK) J7.16(SD_CMD/BCM23) J7.17(3V3) J7.18(SD_DAT0/BCM24) J7.22(SD_DAT1/BCM25) J7.26(!CE01!/BCM7) J7.27(BCM0/ID_SD) J7.28(ID_SC/BCM1) J7.29(BCM5) J7.32(PWM0/BCM12) J7.33(BCM13/PWM1) J7.35(BCM19/MISO1) J7.37(BCM26/SD_DAT2) J7.38(MOSI1/BCM20) J7.40(SCK1/BCM21)

### Notes on the sheet
- 40 PIN SBC (R-PI)
- SMBus
- RPU_BUS
- TX
- DTR
- BUS MANAGER MUST
  PULL UP TO ALLOW 
  MCU NODE BOARD TO 
  DRIVE TX PAIR
- BUS MANAGER MAY
  PULL UP TX_!RE! TO 
  BLOCK TX PAIR FROM 
  HOST
- RX
- BUS MANAGER NEEDS
  TO DRIVE DTR_DE
  BUT A HIGH DTR_TXD
  OVERIDES
- CAT5 HAS 100 OHM 
  IMPEDANCE AND 
  LESS THAN 17.6 
  OHM PER 100 METER. 
  A 1200 METER RUN
  DRIVEN WITH A 3V 
  SIGNAL HAS >500mV
  ON THE FAR
  TERMINATION
- PULL-UP  NEEDED WHEN 
  RX_!RE! IS USED TO BLOCK 
  RX PAIR FROM MCU NODE
- 100 OHM TERMINATION
  IS NEEDED AT EACH
  END OF A CAT5 PAIR.
- RPU_BUS MANAGEMENT
- IF THE 3V3PI IS OFF THE
  74LVC07 OPEN DRAIN IS
  HI-Z (IOFF).
- ONLY EARTH
  AT ONE
   LOCATION
- I2C FROM CNTL TO BUS MGR
- BUS MANAGER MUST
  PULL UP TO ALLOW 
  HOST TO DRIVE
  RX PAIR
- WORKS WITH RPUNO AT 5V
  IF SDA OR SCL IS HIGH THE
  ESD DIODE ON U7 IS AT 
  RISK (E.G. 6MA)
- BUS MANAGER MAY
  PULL UP RX_!RE! TO 
  BLOCK RX PAIR FROM
  MCU NODE BOARD
- PI SHUTDOWN
- SMBus
- Pi Zero has 1.8k pull-up to 3.3V | 7/16/20 | RON S
- CNTL RESET
- 3 ICP+CS, 4 MIX+CS, SPI
  2 I2C, 3 UART, R-PI HDR
- ^2 | 7/16/20
- CRYSTAL:
  ECS-120-20-3X-TR
  12MHZ +/- 30PPM
  STABILITY AND TOLERANCE
  CRYSTAL CAPACITORS:
  20PF = 6.5PF +
  (27PF*27PF)/(27PF+27PF)
- MGR ICSP
- DIVERSON & START CUTOFF
  SHUTDOWN SW OVERIDE
- GRAVIMETRIC
- ^1 | 8/22/19
- ALT PWR DEBUG, MV CTS
  PWR PROTECT,MGR DOES M
- ^0 | 2/14/19
- INIT
- REMOVE ALTERNAT
  POWER BEFOR ISP
  PROGRAMING

## Library data of the parts
C1-C5 C7 C9-C18 C20 C101-C113 C201-C210 = C-C:C: CAPACITOR Symbol
C6 C8 C19 = C-T:CT: Tantalum Electrolytic Capacitor
D2 D202 = D-LED:LED: LED 120120WH [CREE,XHGAWT-00-0000-00000HXE1] LED WHITE 6500K 150LUM-W120120
D3 D201 = D-GP:D: DIODE
HW1 HW2 = HW-DINMnt:MOUNT-HOLE: USA10-4.6 [PhxCont,1202713] DINRAIL ADAPTER UNIVERSAL 10MM 4.6MM
J1 = J-HDR3.5mm:MCV2: MCV 1,5/ 2-G-3,5-RN [PHOENIX CONTACT,1731471] CONN HEADER SHROUDED 2POS 3.5MM MCVR 1,5/ 2-ST-3,5 [PHOENIX CONTACT,1863152] CONN PLUG 2POS SCREW 3.5MM PST 1,0/2-3,5 [PHOENIX CONTACT,1945096] CONN HEADER STRIP PIN 2POS 3.5MM PT1,5/2-PVH-3,5 [PHOENIX CONTACT,1984015] CONN PLUG STRIP 2POS 3.5MM
J2 J4 = J-HDR3.5mm:MCV6: MCV 1,5/6-G-3,5 [PHOENIX CONTACT,1843648] CONN HEADER SHROUDED 6POS 3.5MM MCVR 1,5/6-ST-3,5 [PHOENIX CONTACT,1863194] CONN PLUG 6POS SCREW 3.5MM PST 1,0/6-3,5 [PHOENIX CONTACT,1945135] CONN HEADER STRIP PIN 6POS 3.5MM PT 1,5/6-PVH-3,5 [PHOENIX CONTACT,1984057] CONN PLUG STRIP 6POS 3.5MM Drill Size 3/64": .0469" (1.2mm)
J3 J8 = J-HDR3.5mm:MCV3: MCV 1,5/ 3-G-3,5-RN [PHOENIX CONTACT,1731484] CONN HEADER SHROUDED 3POS 3.5MM MCVR 1,5/ 3-ST-3,5 [PHOENIX CONTACT,1863165] CONN PLUG 3POS SCREW 3.5MM PST 1,0/3-3,5 [PHOENIX CONTACT,1945106] CONN HEADER STRIP PIN 3POS 3.5MM PT1,5&3-PVH-3,5 [PHOENIX CONTACT,1984028] CONN PLUG STRIP 3POS 3.5MM
J5 J6 = J-HDR3.5mm:MCV5: MCV 1,5/5-G-3,5-RN [PHOENIX CONTACT,1843635] CONN HEADER SHROUDED 5POS 3.5MM MCVR 1,5/5-ST-3,5 [PHOENIX CONTACT,1863181] CONN PLUG 5POS SCREW 3.5MM PST 1,0/5-3,5 [PHOENIX CONTACT,1945122] CONN HEADER STRIP PIN 5POS 3.5MM PT 1,5/5-PVH-3,5 [PHOENIX CONTACT,1984044] CONN PLUG STRIP 4POS 3.5MM Drill Size 3/64": .0469" (1.2mm)
J7 = U-Pi:RPI-ZERO: Raspberry Pi Zero https://pinout.xyz/ NOTE: WiFi is needed see https://www.kickstarter.com/projects/1991736672/iot-hat-for-raspberry-pi-a-must-have-for-pi-zero
J9 J10 = J-RJ45:RJ45-8: RJ45 Jack RJ45J [ASSMANN,A-2014-2-4-R] JACK MODULAR VERT PCB 8P8C UNSHIELD Horz version form sparkfun sku PRT-00643, and breakout board sku is BOB-00716.
J11 J12 = U-AVR:ISP-SPI: AVR ISP thru SPI In-System Programming uses the target Atmel AVR’s internal SPI (Serial Peripheral Interface) to download code into the flash and EEPROM memories. It is not a debugging interface. When designing an application PCB which includes an AVR with the SPI interface, this pinout should be used. Sparkfun SKU: BOB-08508
J13 = J-HDR2mm:B04B: B04B [JST@B04B-PASK] CONN HEADER VERT THRU 4POS S04B [JST@S04B-PASK] CONN HEADER SIDE THRU 4POS
J14 = U-AVR:FRIEND: used for serial interfaces and serial bootloaders optiboot does not read the fuse but reports as they should be. It also erases chip. avrdude -c arduino -v -p atmega328p -P /dev/ttyUSB0 -b 115200 -U flash:w:BlinkLED.hex xboot use -e to erase chip, and -u to disable fuse checks since bootloaders can't see them. avrdude -c avr109 -v -p atmega1284p -P /dev/ttyUSB0 -b 115200 -e -u -U flash:w:BlinkLED.hex Arduino uses the nRTS (or nDTR) negative going edge to start the bootloader by causing a reset on the MCU.
L1 = L-FB:L: Ferrite Bead with frequency dependent resistance
Q1 Q3 Q4 Q8 = Q-PCH:N-CH?*: ENHANCEMENT MODE MOSFET SOT23 is BSS138 pinout
Q2 Q6 Q106 Q109-Q115 Q121 Q125 Q129-Q131 Q135 Q136 Q140-Q142 Q146 Q148-Q151 Q201-Q203 = Q-NPN:NPN: BJT NPN General Purpose Amplifier
Q5 Q7 Q101-Q104 Q107 Q108 Q116 Q117 Q119 Q120 Q123 Q124 Q127 Q128 Q133 Q134 Q138 Q139 Q145 Q147 = Q-PNP:PNP: BJT NPN General Purpose Amplifier
Q9-Q11 Q105 Q118 Q122 Q126 Q132 Q137 Q143 Q144 Q152 Q153 = Q-NCH:N-CH?*: ENHANCEMENT MODE MOSFET SOT23 is BSS138 pinout
R1-R17 R101-R163 R201-R240 = R-C:R: Resiistor American-style symbol
S201 = S-Tactile:KSA: KSA0M311 [C&K,KSA0M311LFT] SWITCH TACTILE SEALED SPST-NO 50MA 32V
TP1 TP2 TP4-TP7 TP10 TP35 = J-TP:TP: Test pad
U1 U2 = U-Linear:ZXCT1087: 1087 [DIODES,ZXCT1087E5TA] HISIDE CURRENT MONITOR SOT23-5
U3 U4 = P-DCDC:OKI-78SR: OKI-78SR OKI-78SR-5/1.5-W36H-C 5V@1.5A Horizontal Mount OKI-78SR-5/1.5-W36-C 5V@1.5A Vert Mount OKI-78SR-3.3/1.5-W36H-C 3.3V@1.5A Horizontal Mount OKI-78SR-3.3/1.5-W36-C 3.3V@1.5A Vert Mount Murata Power Solutions 7 to 36 VDC input range need to verify pinout
U5 = U-AVR:ATMEGA324PB-AU: ATmega324PB 32 Kbytes FLASH 2 kbytes SRAM 1 kbytes EEPROM 3 USART 2 I2C 2 SPI 8-channel 10 bit ADC
U8 = P-DCDC:MIC5205: KB33 [MICREL,MIC5205-3.3YM5] REG ULDO 3V3 150MA SOT23-5
U101 U102 = U-Time:ICM7555: ICM7555 [INTERSIL,ICM7555IBAZ-T] TIMER 555 8SOIC note each resistor in Maxim part is 100k +/- 20%
U201 U202 = U-7400:74*07: HEX BUFFER, OPEN DRAIN/COLLECTOR 74LVC07A [DIODES,74LVC07AS14-13] LOGIC BUFFER OPEN DRAIN 14SOIC
U203-U205 = U-Transceiver:ISL3172E: TRANSCEIVER RS485 3.3V HALFDPLX
U206 = U-AVR:ATMEGA328PB-AU: ATmega328PB 4 Kbytes FLASH 128 bytes SRAM 256 bytes EEPROM 2 UART, 2 I2C, 2 SPI 8-channel 10 bit ADC
U$1 = J-BoardHDR:R-PI3B+
U$2-U$4 = H-Fiducial:FIDUCIAL: Fiducial Alignment Points Various fiducial points for machine vision alignment.
Y1 Y201 = Y-XTL:CSM: 16MHZ20 [ECS,ECS-160-20-3X-TR] CRYSTAL 16MHZ 20PF 30PPM CSM-3X
Y2 = Y-XTL:FT5HNBPK: FT5HNBPK16 OSC TCXO 16MHZ 3PPM SM

## Net classes
0 default: width 0.178 mm, drill 0.33 mm